# Altium schematic sheet 原理图.SchDoc
size A4
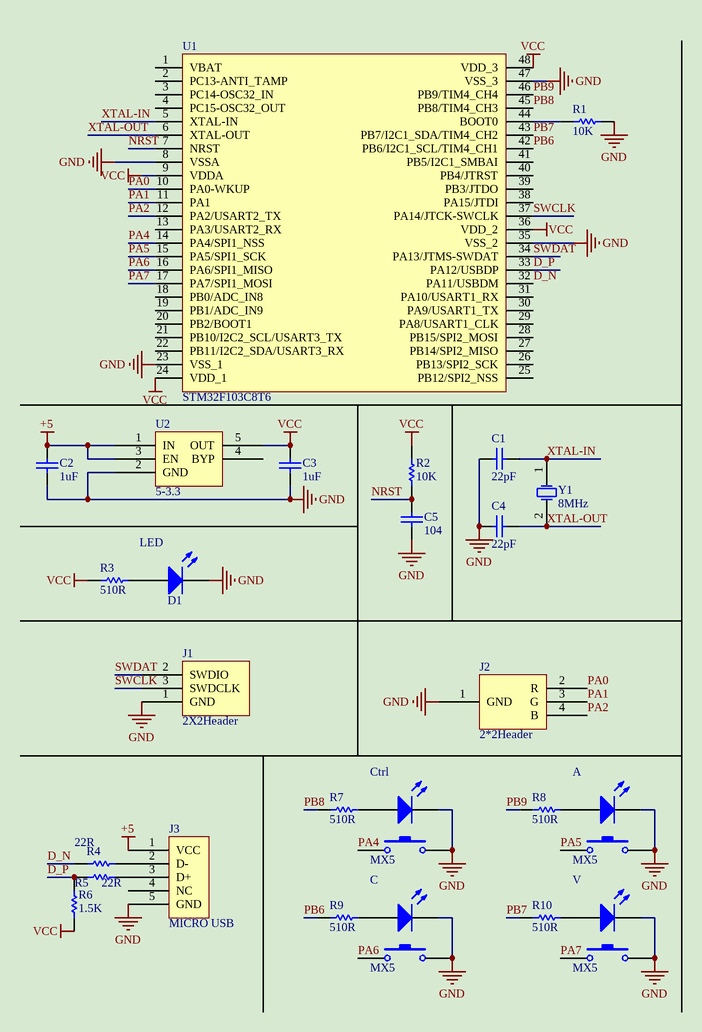
[diagram p0: 原理图.SchDoc]

## Parts
A  MX5  [Key]
C  MX5  [Key]
C1  22pF  [LC-1206_C]
C2  1uF  [LC-1206_C]
C3  1uF  [LC-1206_C]
C4  22pF  [LC-1206_C]
C5  104  [LC-1206_C]
Ctrl  MX5  [Key]
D1  LED  [LC-0603_LED_S3]
J1  2X2Header  [IDE3]
J2  2*2Header  [IDE4_2.54]
J3  MICRO USB  [Micro_USB]
R1  10K  [LC-1206_R]
R2  10K  [LC-1206_R]
R3  510R  [LC-1206_R]
R4  22R  [LC-1206_R]
R5  22R  [LC-1206_R]
R6  1.5K  [LC-1206_R]
R7  510R  [LC-1206_R]
R8  510R  [LC-1206_R]
R9  510R  [LC-1206_R]
R10  510R  [LC-1206_R]
U1  STM32F103C8T6  [lqfp48]
U2  5-3.3  [LC-SOT-23-5]
V  MX5  [Key]
Y1  8MHz  [LC-HC-49S]

## Nets
+5: C2.2 J3.1(VCC) U2.1(IN) U2.3(EN)
GND: A.2 A.K C.2 C.K C1.1 C2.1 C3.1 C4.1 C5.1 Ctrl.2 Ctrl.K D1.K J1.1(GND) J2.1(GND) J3.5(GND) R1.2 U1.8(VSSA) U1.23(VSS_1) U1.35(VSS_2) U1.47(VSS_3) U2.2(GND) V.2 V.K
VCC: C3.2 R2.2 R3.1 R6.1 U1.9(VDDA) U1.24(VDD_1) U1.36(VDD_2) U1.48(VDD_3) U2.5(OUT)
D_N: R4.1 U1.32(PA11/USBDM)
D_P: R5.1 R6.2 U1.33(PA12/USBDP)
NRST: C5.2 R2.1 U1.7(NRST)
PA0: J2.2(R) U1.10(PA0-WKUP)
PA1: J2.3(G) U1.11(PA1)
PA2: J2.4(B) U1.12(PA2/USART2_TX)
PA4: Ctrl.1 U1.14(PA4/SPI1_NSS)
PA5: A.1 U1.15(PA5/SPI1_SCK)
PA6: C.1 U1.16(PA6/SPI1_MISO)
PA7: U1.17(PA7/SPI1_MOSI) V.1
PB6: R9.1 U1.42(PB6/I2C1_SCL/TIM4_CH1)
PB7: R10.1 U1.43(PB7/I2C1_SDA/TIM4_CH2)
PB8: R7.1 U1.45(PB8/TIM4_CH3)
PB9: R8.1 U1.46(PB9/TIM4_CH4)
SWCLK: J1.3(SWDCLK) U1.37(PA14/JTCK-SWCLK)
SWDAT: J1.2(SWDIO) U1.34(PA13/JTMS-SWDAT)
XTAL-IN: C1.2 U1.5(XTAL-IN) Y1.1(OSC1)
XTAL-OUT: C4.2 U1.6(XTAL-OUT) Y1.2(OSC2)
NetA_A: A.A R8.2
NetC_A: C.A R9.2
NetCtrl_A: Ctrl.A R7.2
NetD1_A: D1.A R3.2
NetJ3_2: J3.2(D-) R4.2
NetJ3_3: J3.3(D+) R5.2
NetR1_1: R1.1 U1.44(BOOT0)
NetR10_2: R10.2 V.A

Not connected (* = marked no-connect by the designer): J3 4(NC); U1 1(VBAT) 2(PC13-ANTI_TAMP) 3(PC14-OSC32_IN) 4(PC15-OSC32_OUT) 13(PA3/USART2_RX) 18(PB0/ADC_IN8) 19(PB1/ADC_IN9) 20(PB2/BOOT1) 21(PB10/I2C2_SCL/USART3_TX) 22(PB11/I2C2_SDA/USART3_RX) 25(PB12/SPI2_NSS) 26(PB13/SPI2_SCK) 27(PB14/SPI2_MISO) 28(PB15/SPI2_MOSI) 29(PA8/USART1_CLK) 30(PA9/USART1_TX) 31(PA10/USART1_RX) 38(PA15/JTDI) 39(PB3/JTDO) 40(PB4/JTRST) 41(PB5/I2C1_SMBAI); U2 4(BYP)

## Library data of the parts
A C Ctrl V = Key
C1 C4 = Capacitor: Published: 8-Jun-2000; LatestRevisionDate: 17-Jul-2002; LatestRevisionNote: Re-released for DXP Platform.; PackageReference: RAD-0.3; Publisher: Altium Limited; PackageDescription: Radial Cap, Thru-Hole; 2 Leads; 0.3 in Pin Spacing; Value: 22pF
C2 C3 C5 = Capacitor: Value: 22pF; Published: 8-Jun-2000; LatestRevisionDate: 17-Jul-2002; LatestRevisionNote: Re-released for DXP Platform.; PackageReference: RAD-0.3; Publisher: Altium Limited; PackageDescription: Radial Cap, Thru-Hole; 2 Leads; 0.3 in Pin Spacing
D1 = LED: Typical INFRARED GaAs LED; Published: 8-Jun-2000; LatestRevisionDate: 08-Jul-2005; LatestRevisionNote: Mech Layer 1 removed.; PackageReference: LED-0; Publisher: Altium Limited; PackageDescription: LED; 2 Leads
J1 = J-Link
J2 = RGB_LED
J3 = USB
R1-R10 = Resistor: Value: 150R; Published: 8-Jun-2000; LatestRevisionDate: 17-Jul-2002; LatestRevisionNote: Re-released for DXP Platform.; PackageReference: AXIAL-0.3; Publisher: Altium Limited; PackageDescription: Axial Device, Thru-Hole; 2 Leads; 0.3 in Pin Spacing
U2 = SPX3819
Y1 = XTAL: Crystal Oscillator; Published: 8-Jun-2000; LatestRevisionDate: 17-Jul-2002; LatestRevisionNote: Re-released for DXP Platform.; PackageReference: R38; Publisher: Altium Limited; PackageDescription: Crystal, Thru-Hole; 2 Leads; Body 3.1 x 8.2 mm (Dia.xH)